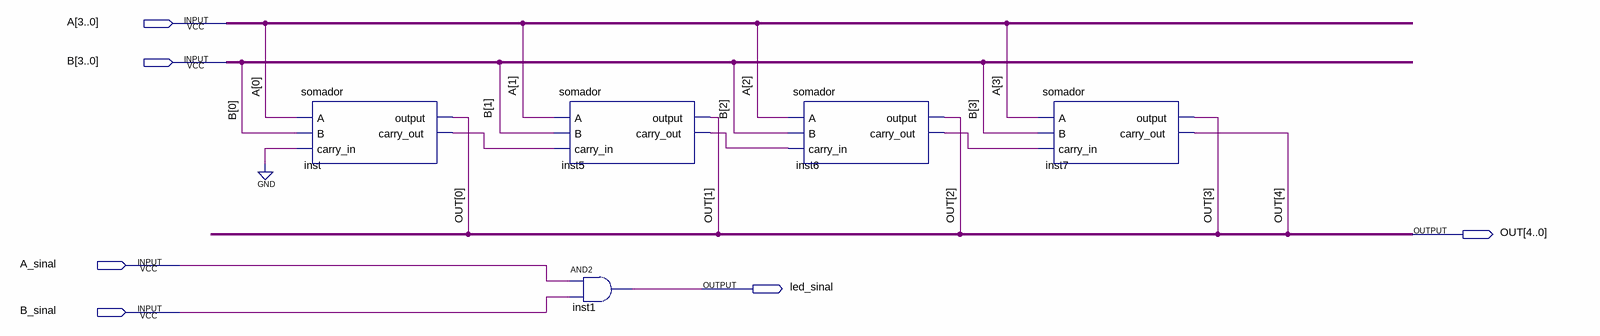
[diagram p0: schematic sheet]
// Quartus schematic SOMADORES_sinaligual.bdf as structural Verilog: 5 symbols, 6 pins
module SOMADORES_sinaligual (
  input  [3:0] A,
  input  [3:0] B,
  input  A_sinal,
  input  B_sinal,
  output [4:0] OUT,
  output led_sinal
);

  wire inst5_carry_out, inst6_carry_out, inst_carry_out;

  somador inst (.A(A[0]), .B(B[0]), .carry_in(1'b0), .\output (OUT[0]), .carry_out(inst_carry_out));
  somador inst5 (.A(A[1]), .B(B[1]), .carry_in(inst_carry_out), .\output (OUT[1]), .carry_out(inst5_carry_out));
  and inst1 (led_sinal, A_sinal, B_sinal);
  somador inst6 (.A(A[2]), .B(B[2]), .carry_in(inst5_carry_out), .\output (OUT[2]), .carry_out(inst6_carry_out));
  somador inst7 (.A(A[3]), .B(B[3]), .carry_in(inst6_carry_out), .\output (OUT[3]), .carry_out(OUT[4]));
endmodule
